# EAGLE design WaterLevel-STM8-V1 (EAGLE 9.6.2)
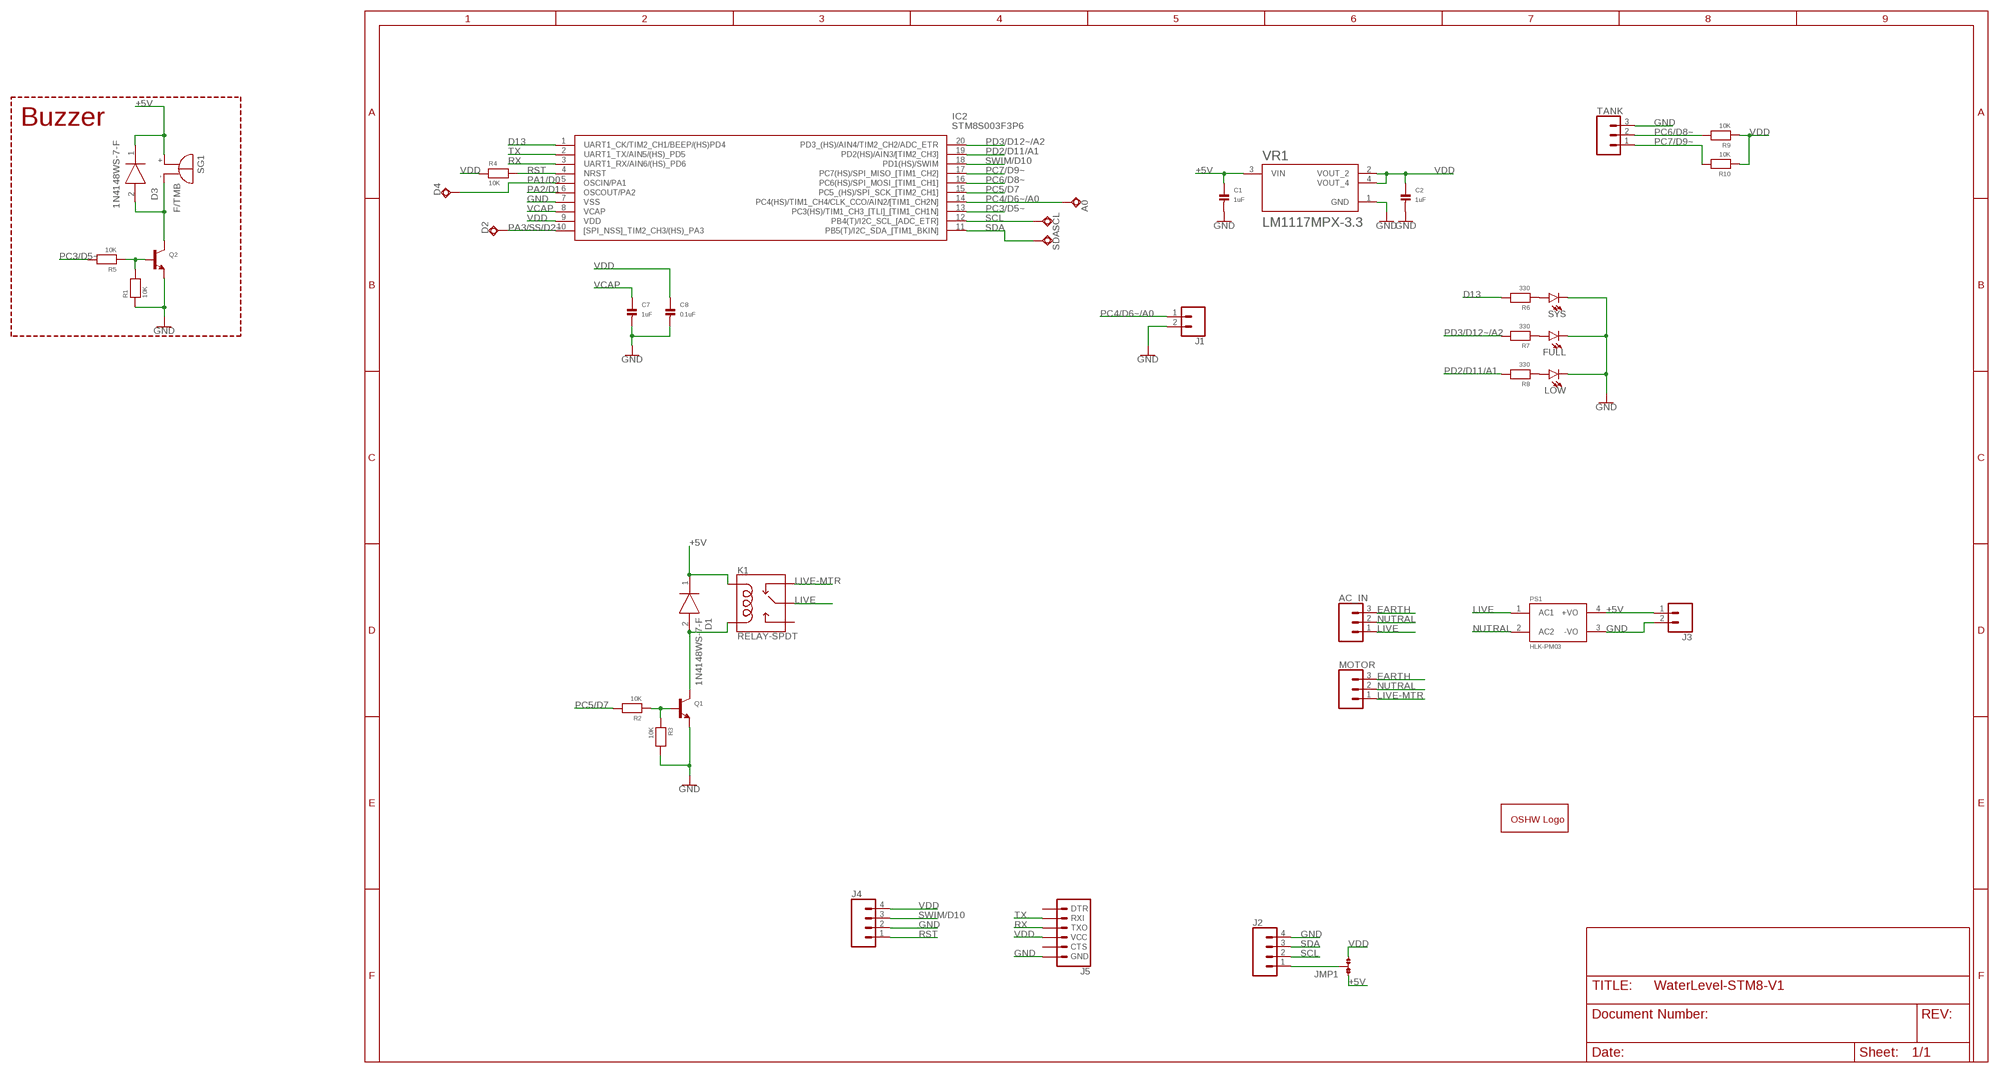
[diagram p0: schematic, sheet 1]

## Parts
A0  TPSQTP20R  [TP20R]
AC_IN  SCREW-CONN_03-SCREW-5MM  [SCREWTERMINAL-5MM-3]
C1  1uF  CAP_CERAMIC0805  [C0805]
C2  1uF  CAP_CERAMIC0805  [C0805]
C7  1uF  CAP_CERAMIC0805  [C0805]
C8  0.1uF  CAP_CERAMIC0805  [C0805]
D1  1N4148WS-7-F  [SOD2513X120N]
D2  TPSQTP20R  [TP20R]
D3  1N4148WS-7-F  [SOD2513X120N]
D4  TPSQTP20R  [TP20R]
FULL  LED-5MM-REC5MM  [LED_5MM]
GOLD_ORB_SM1  OSHWLOGOLOGO16MM  [OSHW_16MM]
IC2  STM8S003F3P6  [SOP65P640X120-20N]
J1  2PIN-2.54MM-POLARPOLAR  [MOLEX-1X2]
J2  CONN_04PTH  [1X04]
J3  2PIN-2.54MM-POLARPOLAR  [MOLEX-1X2]
J4  CONN_04PTH  [1X04]
J5  6_PIN_SERIAL_TARGETSILK  [6_PIN_SERIAL_TARGET_SIDE_W_SILK]
JMP1  JMP-3-NO  [JMP-3-NO]
K1  RELAY-SPDT  [RELAY_G5LE]
LOW  LED-5MM-REC5MM  [LED_5MM]
MOTOR  SCREW-CONN_03-SCREW-5MM  [SCREWTERMINAL-5MM-3]
PS1  HLK-PM03  [CONV_HLK-PM03]
Q1  TRANSISTOR_NPNWIDE  [SOT23-WIDE]
Q2  TRANSISTOR_NPNWIDE  [SOT23-WIDE]
R1  10K  RESISTOR0805  [R0805]
R2  10K  RESISTOR0805  [R0805]
R3  10K  RESISTOR0805  [R0805]
R4  10K  RESISTOR0805  [R0805]
R5  10K  RESISTOR0805  [R0805]
R6  330  RESISTOR0805  [R0805]
R7  330  RESISTOR0805  [R0805]
R8  330  RESISTOR0805  [R0805]
R9  10K  RESISTOR0805  [R0805]
R10  10K  RESISTOR0805  [R0805]
SCL  TPSQTP20R  [TP20R]
SDA  TPSQTP20R  [TP20R]
SG1  F/TMB  [F/TMB]
SYS  LED-5MM-REC5MM  [LED_5MM]
TANK  SCREW-CONN_03-SCREW-5MM  [SCREWTERMINAL-5MM-3]
VR1  LM1117MPX-3.3  [VREG_LM1117MPX-3.3]

## Nets
+5V: C1.1 D1.1(K) D3.1(K) J3.1 JMP1.1 K1.2(COIL1) PS1.4(+VO) SG1.+ VR1.3(VIN)
D13: IC2.1(UART1_CK/TIM2_CH1/BEEP/(HS)PD4) R6.2
EARTH: AC_IN.3 MOTOR.3
GND: C1.2 C2.2 C7.2 C8.2 FULL.K(C) IC2.7(VSS) J1.2 J2.4 J3.2 J4.2 J5.P$6(GND) LOW.K(C) PS1.3(-VO) Q1.2(E) Q2.2(E) R1.1 R3.2 SYS.K(C) TANK.3 VR1.1(GND)
LIVE: AC_IN.1 K1.1(MAIN) PS1.1(AC1)
LIVE-MTR: K1.4(NC) MOTOR.1
N$1: R6.1 SYS.A
N$2: D1.2(A) K1.5(COIL2) Q1.3(C)
N$3: Q1.1(B) R2.1 R3.1
N$4: D3.2(A) Q2.3(C) SG1.-
N$5: Q2.1(B) R1.2 R5.1
N$6: FULL.A R7.1
N$7: LOW.A R8.1
N$8: J2.1 JMP1.2
NUTRAL: AC_IN.2 MOTOR.2 PS1.2(AC2)
PA1/D0: D4.TP IC2.5(OSCIN/PA1)
PA2/D1: IC2.6(OSCOUT/PA2)
PA3/SS/D2~: D2.TP IC2.10([SPI_NSS]_TIM2_CH3/(HS)_PA3)
PC3/D5~: IC2.13(PC3(HS)/TIM1_CH3_[TLI]_[TIM1_CH1N]) R5.2
PC4/D6~/A0: A0.TP IC2.14(PC4(HS)/TIM1_CH4/CLK_CCO/AIN2/[TIM1_CH2N]) J1.1
PC5/D7: IC2.15(PC5_(HS)/SPI_SCK_[TIM2_CH1]) R2.2
PC6/D8~: IC2.16(PC6(HS)/SPI_MOSI_[TIM1_CH1]) R9.2 TANK.2
PC7/D9~: IC2.17(PC7(HS)/SPI_MISO_[TIM1_CH2]) R10.2 TANK.1
PD2/D11/A1: IC2.19(PD2(HS)/AIN3/[TIM2_CH3]) R8.2
PD3/D12~/A2: IC2.20(PD3_(HS)/AIN4/TIM2_CH2/ADC_ETR) R7.2
RST: IC2.4(NRST) J4.1 R4.2
RX: IC2.3(UART1_RX/AIN6/(HS)_PD6) J5.P$2(TXO)
SCL: IC2.12(PB4(T)/I2C_SCL_[ADC_ETR]) J2.2 SCL.TP
SDA: IC2.11(PB5(T)/I2C_SDA_[TIM1_BKIN]) J2.3 SDA.TP
SWIM/D10: IC2.18(PD1(HS)/SWIM) J4.3
TX: IC2.2(UART1_TX/AIN5/(HS)_PD5) J5.P$3(RXI)
VCAP: C7.1 IC2.8(VCAP)
VDD: C2.1 C8.1 IC2.9(VDD) J4.4 J5.P$4(VCC) JMP1.3 R4.1 R9.1 R10.1 VR1.2(VOUT_2) VR1.4(VOUT_4)
Unconnected: J5.P$1(DTR) J5.P$5(CTS) K1.3(NO)

## Notes on the sheet
- Buzzer

## Library data of the parts
A0 D2 D4 SCL SDA = testpad:TPSQ: Test pad
AC_IN MOTOR TANK = electroShri:SCREW-CONN_03: Multi connection point. Often used as Generic Header-pin footprint for 0.1 inch spaced/style header connections On any of the 0.1 inch spaced packages, you can populate with these: Break Away Headers - Straight <https://www.sparkfun.com/products/116> (PRT-00116) Break Away Male Headers - Right Angle <https://www.sparkfun.com/products/553> (PRT-00553) Female Headers <https://www.sparkfun.com/products/115> (PRT-00115) Break Away Headers - Machine Pin <https://www.sparkfun.com/products/117> (PRT-00117) Break Away Female Headers - Swiss Machine Pin <https://www.sparkfun.com/products/743> (PRT-00743) Stackable Header - 3 Pin (Female, 0.1") <https://www.sparkfun.com/products/13875> (PRT-13875) For SCREWTERMINALS and SPRING TERMINALS visit here: Screw Terimnals on SparkFun.com <https://www.sparkfun.com/search/results?term=Screw+Terminals> (5mm/3.5mm/2.54mm spacing) This device is also useful as a general connection point to wire up your design to another part of your project. Our various solder wires solder well into these plated through hole pads. Hook-Up Wire - Assortment (Stranded, 22 AWG) <https://www.sparkfun.com/products/11375> (PRT-11375) Hook-Up Wire - Assortment (Solid Core, 22 AWG) <https://www.sparkfun.com/products/11367> (PRT-11367) View the entire wire category on our website here <https://www.sparkfun.com/categories/141> Special notes: Molex polarized connector foot print use with SKU : PRT-08232 with associated crimp pins and housings.; PROD_ID: CONN-10134; SF_SKU: PRT-08433
C1 C2 C7 C8 = eventHorizon:CAP_CERAMIC: Ceramic Capacitors 0402 - 0402 Surface Mount Capacitors 16pF 50V 5% [Digikey: 445-4899-2-ND] 18pF 50V 5% [Digikey: 490-1281-2-ND] 22pF 50V 5% [Digikey: 490-1283-2-ND] 68pF 50V 5% [Digikey: 490-1289-2-ND] 0.1uF 10V 10% [Digikey: 490-1318-2-ND] 1.0uF 6.3V 10% [Digikey: 490-1320-2-ND] 0603 - 0603 Surface Mount Capacitors 16 pF 50V 5% [Digikey: 445-5051-2-ND] 22 pF 50V [Digikey: PCC220ACVTR-ND] 33 pF 50V 5% [Digikey: 490-1415-1-ND] 56pF 50V 5% [Digikey: 490-1421-1-ND] 220pF 50V 5% [Digikey: 445-1285-1-ND] 680 pF 50V 2200 pF 50V 5% C0G [Digikey: 445-1297-1-ND] 5600 pF 100V 5% X7R [Digikey: 478-3711-1-ND] 0.1 µF 25V 10% [Digikey: PCC2277TR-ND] 0.22 µF 16V 10% X7R [Digikey: 445-1318-1-ND] 1.0 µF 25V 10% [Digikey: 445-5146-2-ND] 0603 - RF Specific 3pF 250V +/-0.1pF RF [Digikey: 712-1347-1-ND] 18 pF 250V 5% [Digikey: 478-3505-1-ND or 712-1322-1-ND] 56 pF 250V 5% C0G RF [Digikey: 490-4867-1-ND] 68 pF 250V RF [Digikey: 490-4868-1-ND] 0805 - 0805 Surface Mount Capacitors 220 pF 250V 2% RF Ceramic Capacitor [Digikey: 712-1398-1-ND] 1000 pF 50V 2% NP0 Ceramic Capacitor [Digikey: 478-3760-1-ND] 0.1 µF 25V 10% Ceramic Capacitor [Digikey: PCC1828TR-ND] 1.0 µF 16V 10% Ceramic Capacitor[Digikey: 490-1691-2-ND] 10.0 µF 10V 10% Ceramic Capacitor[Digikey: 709-1228-1-ND] 10.0 uF 16V 10% Ceramic Capacitor [Digikey: 478-5165-2-ND] 47 uF 6.3V 20% Ceramic Capacitor [Digikey: 587-1779-1-ND or 399-5506-1-ND] 1206 - 1206 Surface Mount Capacitors 47uF 10V 20% Ceramic Capacitor [Digikey: 490-5528-1-ND or 399-5508-1-ND or 445-6010-1-ND] 100uF 6.3V -20%, +80% Y5V Ceramic Capacitor (Digikey: 490-4512-1-ND, Mouser: 81-GRM31CF50J107ZE1L)
D1 D3 = electroShri:1N4148WS-7-F: Diode Switching 150mA 75V 200mW SOD323 Diodes Inc 1N4148WS-7-F Switching Diode, 150mA 75V, 2-Pin SOD-323 Source: Datasheet <https://componentsearchengine.com/Datasheets/2/1N4148WS-7-F.pdf>; ARROW_PART_NUMBER: 1N4148WS-7-F; ARROW_PRICE-STOCK: https://www.arrow.com/en/products/1n4148ws-7-f/diodes-incorporated; DESCRIPTION: Diode Switching 150mA 75V 200mW SOD323 Diodes Inc 1N4148WS-7-F Switching Diode, 150mA 75V, 2-Pin SOD-323; HEIGHT: 1.2mm; MANUFACTURER_NAME: Diodes Inc.; MANUFACTURER_PART_NUMBER: 1N4148WS-7-F; MOUSER_PART_NUMBER: 621-1N4148WS-F; MOUSER_PRICE-STOCK: https://www.mouser.co.uk/ProductDetail/Diodes-Incorporated/1N4148WS-7-F?qs=4drIV0IxA0r8aNy7%2Fu4kVw%3D%3D
FULL LOW SYS = electroShri:LED-5MM-REC: LED (Generic) Standard schematic elements and footprints for 5mm, 3mm, 1206, and 0603 sized LEDs. Generic LEDs with no color specified.
GOLD_ORB_SM1 = electroShri:OSHWLOGO: The OSHW logo for PCB layout
IC2 = electroShri:STM8S003F3P6: STMICROELECTRONICS - STM8S003F3P6 - MCU, 8BIT, STM8, 16MHZ, TSSOP-20 Source: Datasheet <http://www.st.com/web/en/resource/technical/document/datasheet/DM00024550.pdf>; ARROW_PART_NUMBER: STM8S003F3P6; ARROW_PRICE-STOCK: https://www.arrow.com/en/products/stm8s003f3p6/stmicroelectronics; DESCRIPTION: STMICROELECTRONICS - STM8S003F3P6 - MCU, 8BIT, STM8, 16MHZ, TSSOP-20; HEIGHT: 1.2mm; MANUFACTURER_NAME: STMicroelectronics; MANUFACTURER_PART_NUMBER: STM8S003F3P6; MOUSER_PART_NUMBER: 511-STM8S003F3P6; MOUSER_PRICE-STOCK: https://www.mouser.co.uk/ProductDetail/STMicroelectronics/STM8S003F3P6?qs=vV0pr1uq7fD%252BGii5YhjnYw%3D%3D
J1 J3 = electroShri:2PIN-2.54MM-POLAR: Multi connection point. Often used as Generic Header-pin footprint for 0.1 inch spaced/style header connections On any of the 0.1 inch spaced packages, you can populate with these: Break Away Headers - Straight <https://www.sparkfun.com/products/116> (PRT-00116) Break Away Male Headers - Right Angle <https://www.sparkfun.com/products/553> (PRT-00553) Female Headers <https://www.sparkfun.com/products/115> (PRT-00115) Break Away Headers - Machine Pin <https://www.sparkfun.com/products/117> (PRT-00117) Break Away Female Headers - Swiss Machine Pin <https://www.sparkfun.com/products/743> (PRT-00743) For SCREWTERMINALS and SPRING TERMINALS visit here: Screw Terimnals on SparkFun.com <https://www.sparkfun.com/search/results?term=Screw+Terminals> (5mm/3.5mm/2.54mm spacing) This device is also useful as a general connection point to wire up your design to another part of your project. Our various solder wires solder well into these plated through hole pads. Hook-Up Wire - Assortment (Stranded, 22 AWG) <https://www.sparkfun.com/products/11375> (PRT-11375) Hook-Up Wire - Assortment (Solid Core, 22 AWG) <https://www.sparkfun.com/products/11367> (PRT-11367) View the entire wire category on our website here <https://www.sparkfun.com/categories/141> Special notes: Molex polarized connector foot print use with: PRT-08233 with associated crimp pins and housings. 2.54_SCREWTERM for use with PRT-10571. 3.5mm Screw Terminal footprints for PRT-08084 5mm Screw Terminal footprints for use with PRT-08432; SF_ID: PRT-09918
J2 J4 = SparkFun-Connectors:CONN_04: Multi connection point. Often used as Generic Header-pin footprint for 0.1 inch spaced/style header connections On any of the 0.1 inch spaced packages, you can populate with these: Break Away Headers - Straight <https://www.sparkfun.com/products/116> (PRT-00116) Break Away Male Headers - Right Angle <https://www.sparkfun.com/products/553> (PRT-00553) Female Headers <https://www.sparkfun.com/products/115> (PRT-00115) Break Away Headers - Machine Pin <https://www.sparkfun.com/products/117> (PRT-00117) Break Away Female Headers - Swiss Machine Pin <https://www.sparkfun.com/products/743> (PRT-00743) For SCREWTERMINALS and SPRING TERMINALS visit here: Screw Terimnals on SparkFun.com <https://www.sparkfun.com/search/results?term=Screw+Terminals> (5mm/3.5mm/2.54mm spacing) This device is also useful as a general connection point to wire up your design to another part of your project. Our various solder wires solder well into these plated through hole pads. Hook-Up Wire - Assortment (Stranded, 22 AWG) <https://www.sparkfun.com/products/11375> (PRT-11375) Hook-Up Wire - Assortment (Solid Core, 22 AWG) <https://www.sparkfun.com/products/11367> (PRT-11367) View the entire wire category on our website here <https://www.sparkfun.com/categories/141> Special notes: Molex polarized connector foot print use with SKU : PRT-08231 with associated crimp pins and housings. 1MM SMD Version SKU: PRT-10208; PROD_ID: CONN-09696
J5 = electroShri:6_PIN_SERIAL_TARGET: 6-pin header connection for use with the "FTDI BASIC" pinout - TARGET SIDE. Also known as "Arduino Serial Program Header". It is used to mate with our FTDI Basic serial programmers using the Arduino IDE. Note, this device has "TARGET" in the name. It is intended to be used on a design that contains a target micro-controller that you wish to program. The "sister" device, named "CABLE" is inteneded to be used on a design that usually lives on the end of your USB cable and prvides the converter chip (FTDI232 or FTDI231x) to commnicate serial RX/TX. You can populate with some of these: Break Away Headers - Straight <https://www.sparkfun.com/products/116> (PRT-00116) For reference (or to suit your programming needs) check out these designs: SparkFun FTDI Basic Breakout - 5V <https://www.sparkfun.com/products/9716> (DEV-09716) SparkFun FTDI Basic Breakout - 3.3V <https://www.sparkfun.com/products/9873> (DEV-09873) SparkFun FTDI SmartBasic <https://www.sparkfun.com/products/12935> (DEV-12935) SparkFun Beefy 3 - FTDI Basic Breakout <https://www.sparkfun.com/products/13746> (DEV-13746)
JMP1 = PatternAgents-ProtoPads:JMP-3-NO: Three Terminal Jumper - Normally Open All Pads Open (unconnected) PatternAgents ProtoPads Library Schematic and PCB layout libraries for design patterns by PatternAgents. For the CADSoft Eagle CAD program : http://www.cadsoftusa.com/download-eagle/ Source LBR : http://www.patternagents.com Github : https://github.com/PatternAgents License : http://creativecommons.org/licenses/by-sa/4.0/ (Creative Commons 4.0) THIS SOFTWARE IS PROVIDED BY THE CONTRIBUTORS "AS IS" AND WITHOUT ANY EXPRESS OR IMPLIED WARRANTIES, INCLUDING, BUT NOT LIMITED TO, THE IMPLIED WARRANTIES OF MERCHANTABILITY AND FITNESS FOR A PARTICULAR PURPOSE ARE DISCLAIMED. IN NO EVENT SHALL THE COPYRIGHT OWNER OR CONTRIBUTORS BE LIABLE FOR ANY DIRECT, INDIRECT, INCIDENTAL, SPECIAL, EXEMPLARY, OR CONSEQUENTIAL DAMAGES (INCLUDING, BUT NOT LIMITED TO, PROCUREMENT OF SUBSTITUTE GOODS OR SERVICES; LOSS OF USE, DATA, OR PROFITS; OR BUSINESS INTERRUPTION) HOWEVER CAUSED AND ON ANY THEORY OF LIABILITY, WHETHER IN CONTRACT, STRICT LIABILITY, OR TORT (INCLUDING NEGLIGENCE OR OTHERWISE) ARISING IN ANY WAY OUT OF THE USE OF THIS SOFTWARE, EVEN IF ADVISED OF THE POSSIBILITY OF SUCH DAMAGE.; BOM: EXCLUDE
K1 = electroShri:RELAY-SPDT: SPDT Electromechanical Relay Single-pole, double-throw sealed relays. When current is applied to the coil, it throws a simple changeover switch, terminating the connection from the NC contact to ground and closing the NO contact. Use them to switch high voltage/high current devices. SparkFun Products JQX-15F: Relay SPDT Sealed - 20A <https://www.sparkfun.com/products/10924> (COM-10924) JZC-11F: Relay SPDT Sealed <https://www.sparkfun.com/products/100> (COM-00100); PROD_ID: COMP-14214
PS1 = electroShri:HLK-PM03: AC DC 3W power module; AVAILABILITY: Unavailable; MF: Hi-link; MP: HLK-PM03; PACKAGE: Package; PRICE: None
Q1 Q2 = eventHorizon:TRANSISTOR_NPN: NPN Transistor Transistor (NPN) 500mA 45V - BC817 [Digikey: 568-1631-1-ND] Transistor (NPN) 500mA 45V - BC817,215 [Mouser: 771-BC817-T/R] SOT23-R - SOT23 footprint optimised for use with solder paste and reflow ovens. SOT23-W - SOT23 footprint optimised for hand-soldering (larger pads).
R1-R10 = eventHorizon:RESISTOR: Resistors 0402 - 0402 Surface Mount Package 22 Ohm 1% 1/16W [Digikey: 311-22.0LRTR-ND] 33 Ohm 5% 1/16W 1.0K 5% 1/16W 1.5K 5% 1/16W 2.0K 1% 1/16W 10.0K 1% 1/16W [Digikey: 311-10.0KLRTR-ND] 10.0K 5% 1/16W [Digikey: RMCF0402JT10K0TR-ND] 12.1K 1% 1/16W [Digikey: 311-22.0LRTR-ND] 100.0K 5% 1/16W 0603 - 0603 Surface Mount Package 0 Ohm 1/10 Watt 1% Resistor 15 Ohm 1/10 Watt 1% Resistor 33 Ohm 1/10 Watt 1% Resistor 49.9 Ohm 1/10 Watt 1% Resistor 100 Ohm 1/10 Watt 1% Resistor 150 Ohm 1/10 Watt 1% Resistor 240 Ohm 1/10 Watt 1% Resistor 390 Ohm 1/10 Watt 1% Resistor 560 Ohm 1/10 Watt 1% Resistor 680 Ohm 1/10 Watt 1% Resistor 750 Ohm 1/10 Watt 1% Resistor 1.0K Ohm 1/10 Watt 1% Resistor 1.5K Ohm 1/10 Watt 1% Resistor 2.0K Ohm 1/10 Watt 1% Resistor 2.2K Ohm 1/10 Watt 1% Resistor 3.3K Ohm 1/10 Watt 1% Resistor 4.7K Ohm 1/10 Watt 1% Resistor 10.0K Ohm 1/10 Watt 1% Resistor 12.0K Ohm 1/10 Watt 1% Resistor 12.1K Ohm 1/10 Watt 1% Resistor 20.0K Ohm 1/10 Watt 1% Resistor 33.0K Ohm 1/10 Watt 1% Resistor 100.0K Ohm 1/10 Watt 1% Resistor 0805 - 0805 Surface Mount Package 0 Ohm 1/8 Watt 1% Resistor 33 Ohm 1/8 Watt 1% Resistor 100 Ohm 1/8 Watt 1% Resistor 150 Ohm 1/8 Watt 1% Resistor 200 Ohm 1/8 Watt 1% Resistor 240 Ohm 1/8 Watt 1% Resistor 330 Ohm 1/8 Watt 1% Resistor 390 Ohm 1/8 Watt 1% Resistor 470 Ohm 1/8 Watt 1% Resistor 1.0K Ohm 1/8 Watt 1% Resistor 1.5K Ohm 1/8 Watt 1% Resistor 2.0K Ohm 1/8 Watt 1% Resistor 4.7K Ohm 1/8 Watt 1% Resistor 5.1K Ohm 1/8 Watt 1% Resistor 5.6K Ohm 1/8 Watt 1% Resistor 10.0K Ohm 1/8 Watt 1% Resistor 22.0K Ohm 1/8 Watt 1% Resistor 33.0K Ohm 1/8 Watt 1% Resistor 100K Ohm 1/8 Watt 1% Resistor 1206 - 1206 Surface Mount Package 2012 - 2010 Surface Mount Package 0.11 Ohm 1/2 Watt 1% Resistor - Digikey: RHM.11UCT-ND
SG1 = eventHorizon:F/TMB: BUZZER Source: Buerklin; OC_FARNELL: unknown; OC_NEWARK: unknown
VR1 = electroShri:LM1117MPX-3.3: 800-mA 15-V linear voltage regulator 4-SOT-223 0 to 125 Check prices <https://snapeda.com/parts/LM1117MPX-3.3/Texas%20Instruments/view-part/?ref=eda>; AVAILABILITY: Warning; DESCRIPTION: 800-mA 15-V linear voltage regulator 4-SOT-223; MF: Texas Instruments; MOUSER-PURCHASE-URL: https://snapeda.com/shop?store=Mouser&id=78946; MP: LM1117MPX-3.3; PACKAGE: SOT-223-4 Texas Instruments; PRICE: None; TEXAS_INSTRUMENTS-PURCHASE-URL: https://snapeda.com/shop?store=Texas+Instruments&id=78946

## Net classes
0 default: width 0.203 mm, drill 0.356 mm, clearance 0.254 mm

## Board
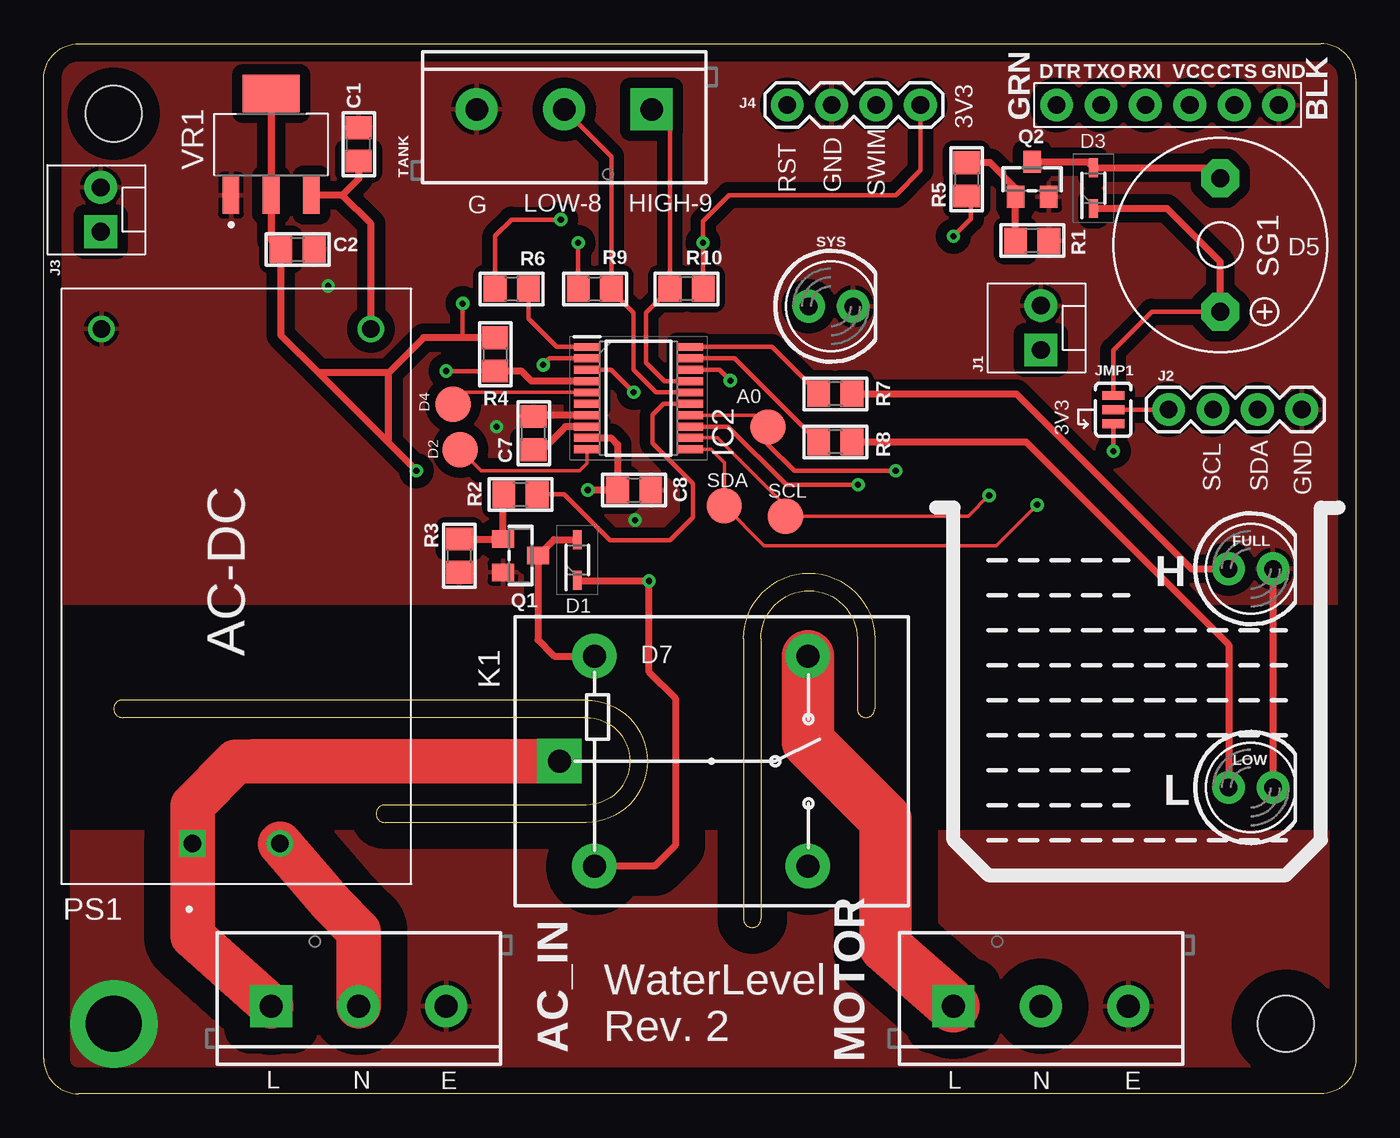
[diagram p1: board, top side]
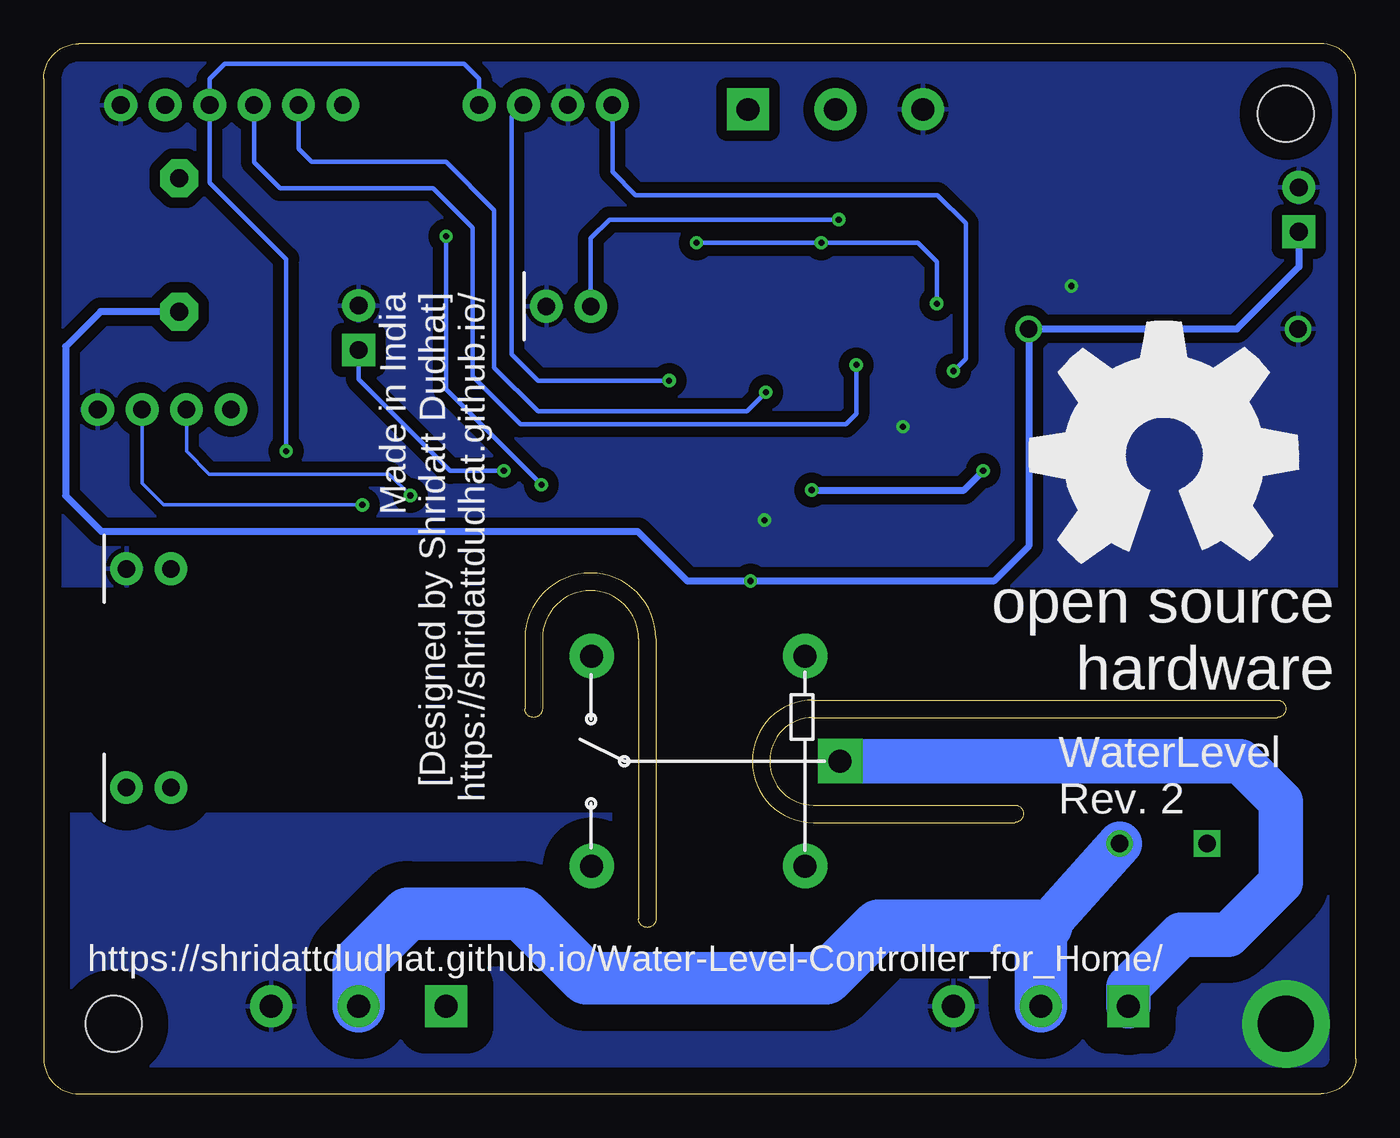
[diagram p2: board, bottom side, seen from below]

Size 75 x 60 mm. Coordinates in mm from the lower left corner, seen from the top.
Outline: 0,2 0,58 arc-90 2,60 73,60 arc-90 75,58 75,2 arc-90 73,0 2,0 arc-90 0,2
Outline: 31,16.5 19.5,16.5 arc180 19.5,15.5 31,15.5 arc180 31,22.5 4.5,22.5 arc180 4.5,21.5 31,21.5 arc-180 31,16.5
Outline: 46.5,26 46.5,22 arc180 47.5,22 47.5,26 arc180 40,26 40,10 arc180 41,10 41,26 arc-180 46.5,26
Copper layers (1*16): Top 0.035mm / dielectric 1.5mm / Bottom 0.035mm
Design rules "default": minimum track width 6mil, minimum drill 0.35mm, track to track 6mil, track to pad 6mil, pad to pad 6mil, via to via 6mil, smd to smd 6mil, copper to edge 40mil, drill to drill 6mil, minimum pad ring 10mil, minimum via ring 8mil, stop-mask expansion 4mil, vias tented up to drill 0mil, thermal gap 10mil
Holes 3.2 mm at 71,4 4,56

### Footprints (pad centres in the part's own frame; a part is rotated, then mirrored left to right if it is on the bottom)
TP20R = smd 2 x 2: TP 0,0
SCREWTERMINAL-5MM-3 = drill 1.3 pad 2.413 square: 1 0,0 | drill 1.3 pad 2.413: 2 5,0; 3 10,0
C0805 = smd 1.3 x 1.5: 1 -0.95,0; 2 0.95,0
SOD2513X120N = smd 1.075 x 0.5: 1 -1.162,0; 2 1.162,0
LED_5MM = drill 1 pad 1.88: A -1.27,0; K 1.27,0
SOP65P640X120-20N = smd 1.475 x 0.45: 1 -2.938,2.925; 2 -2.938,2.275; 3 -2.938,1.625; 4 -2.938,0.975; 5 -2.938,0.325; 6 -2.938,-0.325; 7 -2.938,-0.975; 8 -2.938,-1.625; 9 -2.938,-2.275; 10 -2.938,-2.925; 11 2.938,-2.925; 12 2.938,-2.275; 13 2.938,-1.625; 14 2.938,-0.975; 15 2.938,-0.325; 16 2.938,0.325; 17 2.938,0.975; 18 2.938,1.625; 19 2.938,2.275; 20 2.938,2.925
MOLEX-1X2 = drill 1.016 pad 1.88 square: 1 0,0 | drill 1.016 pad 1.88: 2 2.54,0
1X04 = drill 1.016 pad 1.88: 1 0,0; 2 2.54,0; 3 5.08,0; 4 7.62,0
6_PIN_SERIAL_TARGET_SIDE_W_SILK = drill 1.016 pad 1.88: P$1 -6.35,0; P$2 -3.81,0; P$3 -1.27,0; P$4 1.27,0; P$5 3.81,0; P$6 6.35,0
JMP-3-NO = smd 0.508 x 1.27: 1 -0.813,0; 2 0,0; 3 0.813,0
RELAY_G5LE = drill 1.3 pad 2.54 square: 1 8.52,-0.005 | drill 1.3 pad 2.54: 2 6.52,5.995; 3 -5.68,5.995; 4 -5.68,-6.005; 5 6.52,-6.005
CONV_HLK-PM03 = drill 1 square: 1 -14.7,2.5 | drill 1: 2 -14.7,-2.5; 3 14.7,7.7; 4 14.7,-7.7
SOT23-WIDE = smd 1 x 1.27: 1 -0.95,-1; 2 0.95,-1; 3 0,1
R0805 = smd 1.3 x 1.5: 1 -0.95,0; 2 0.95,0
F/TMB = drill 1.016 pad 2.159 octagon: + 3.81,0; - -3.81,0
VREG_LM1117MPX-3.3 = smd 2.15 x 0.95: 1 -2.9,2.3; 2 -2.9,0; 3 -2.9,-2.3 | smd 2.15 x 3.25: 4 2.9,0

### Placement (x,y rotation side)
A0  41.4,38.1 0 top
AC_IN  13,5 0 top
C1  18,54.25 90 top
C2  14.5,48.25 0 top
C7  28,37.75 90 top
C8  33.75,34.5 0 top
D1  30.5,30.5 90 top
D2  23.8,36.8 0 top
D3  60,51.75 90 top
D4  23.4,39.4 0 top
FULL  69,30 0 top
GOLD_ORB_SM1  11,36.5 0 bottom
IC2  34,39.75 0 top
J1  57,42.5 90 top
J2  64.3,39.1 0 top
J3  3.25,49.25 90 top
J4  42.5,56.5 0 top
J5  64.25,56.5 0 top
JMP1  61.14,39.09 270 top
K1  38,19 180 top
LOW  69,17.5 0 top
MOTOR  52,5 0 top
PS1  11,29 90 top
Q1  27.25,30.75 270 top
Q2  56.5,52.25 0 top
R1  56.5,48.75 180 top
R2  27.25,34.25 0 top
R3  23.75,30.75 270 top
R4  25.8,42.25 270 top
R5  52.75,52.25 270 top
R6  26.75,46 0 top
R7  45.25,40 180 top
R8  45.25,37.25 180 top
R9  31.5,46 0 top
R10  36.75,46 180 top
SCL  42.4,33 0 top
SDA  38.9,33.6 0 top
SG1  67.25,48.5 270 top
SYS  45,45 0 top
TANK  34.75,56.25 180 top
VR1  13,54.25 90 top

### Tracks (layer width: path | path; a pad name or v marks a point on that pad's centre or on a via)
+5V  (via drill 0.36)
  Top 0.254: JMP1.1 61.14,42.5 63.33,44.69 SG1.+
  Top 0.406: PS1.4 18.7,49.7 17.05,51.35 | 17.05,51.35 VR1.3 | C1.1 18,52.3 17.05,51.35 | K1.2 34.9,13.01 36.1,14.2 36.1,22.6 34.6,24.1 v34.6,29.3 30.54,29.3 D1.1 | D3.1 64.21,50.59 67.25,47.55 SG1.+
  Bottom 0.406: J3.1 3.25,47.25 6.8,43.7 PS1.4 18.7,31.3 20.7,29.3 v34.6,29.3 38.21,29.3 41.03,32.12 71.69,32.12 73.75,34.18 73.75,42.69 71.75,44.69 SG1.+
D13
  Top 0.254: IC2.1 29.32,42.67 27.7,44.3 R6.2
EARTH  (via drill 3.2 pad 5)
  other vias: 4,4
  pour Top (isolate 1.5): -1,15 -1,-1 77,-1 77,15
  pour Bottom (isolate 1.5): -2,16 -2,-2 76,-2 76,16
GND  (via drill 0.35)
  Top 0.406: IC2.7 28.07,38.77 C7.2 | FULL.K LOW.K
  other vias: 16.26,46.16 25.89,38.11 33.8,32.78
  pour Top (isolate 0.61): -1,28 -1,61 76,61 76,28
  pour Bottom (isolate 0.61): -0.5,29 -0.5,60.5 75.5,60.5 75.5,29
LIVE
  Top 2.54: K1.1 12.01,19 10.98,18.98 8.5,16.5 PS1.1 8.5,9 AC_IN.1
  Bottom 2.54: K1.1 6.61,19 4.3,16.7 4.3,12.1 7.3,9.1 10,9.1 13,6.1 AC_IN.1
LIVE-MTR
  Top 3: K1.4 43.68,20.12 48.1,15.7 48.1,8.4 MOTOR.1
N$1  (via drill 0.36)
  Top 0.254: R6.1 25.8,49.02 26.73,49.95 v29.56,49.95
  Bottom 0.254: v29.56,49.95 42.67,49.95 43.73,48.89 SYS.A
N$2
  Top 0.406: D1.2 29.16,31.66 Q1.3 28.25,25.93 29.18,25 K1.5
N$3
  Top 0.406: R3.1 Q1.1 26.25,34.2 R2.1
N$4
  Top 0.406: Q2.3 59.66,53.25 D3.2 66.65,52.91 SG1.-
N$5
  Top 0.406: R1.2 Q2.1 55.55,51.75 54.1,53.2 R5.1
N$6
  Top 0.406: R7.1 55.6,40 65.6,30 FULL.A
N$7
  Top 0.406: R8.1 56.15,37.25 67.73,25.67 LOW.A
N$8
  Top 0.254: JMP1.2 J2.1
NUTRAL
  Top 2.54: PS1.2 16.5,10.8 18,9.3 AC_IN.2
  Bottom 2.54: PS1.2 17.7,9.6 18,9.3
  Bottom 3: 17.7,9.6 27.3,9.6 30.3,6.6 44,6.6 47.7,10.3 54.2,10.3 57,7.5 MOTOR.2 | AC_IN.2 18,9.3
PA1/D0
  Top 0.203: IC2.5 24.07,40.08 D4.TP
PA3/SS/D2~
  Top 0.203: IC2.10 31.06,36.02 30.64,35.6 25,35.6 D2.TP
PC3/D5~  (via drill 0.36)
  Top 0.254: IC2.13 39.12,38.12 42.45,34.8 v46.55,34.8 | v52,49 53,50 53,51.05 R5.2
  Bottom 0.254: v46.55,34.8 52,40.25 v52,49
PC4/D6~/A0  (via drill 0.36)
  Top 0.203: IC2.14 40.73,38.77 A0.TP
  Top 0.254: A0.TP 41.4,37.1 42.9,35.6 v48.7,35.6
  Bottom 0.254: v48.7,35.6 51.77,35.6 57,40.83 J1.1
PC5/D7
  Top 0.254: R2.2 29.75,34.25 32.37,31.63 35.81,31.63 37.12,32.94 37.12,34.85 34.81,37.16 34.81,38.81 35.42,39.42 IC2.15
PC6/D8~
  Top 0.254: IC2.16 34.99,40.08 33.71,41.36 33.71,44.64 32.45,45.9 R9.2 32.45,53.55 TANK.2
PC7/D9~
  Top 0.254: IC2.17 35.48,40.73 34.43,41.77 34.43,44.63 R10.2 35.8,55.2 TANK.1
PD2/D11/A1
  Top 0.254: IC2.19 39.48,42.02 44.25,37.25 R8.2
PD3/D12~/A2
  Top 0.254: IC2.20 41.62,42.67 R7.2
RST  (via drill 0.36)
  Top 0.254: R4.2 v23,41.3
  Top 0.406: IC2.4 27.88,40.73 27.3,41.3 R4.2
  Bottom 0.254: v23,41.3 22.3,42 22.3,49.73 23.92,51.35 41.16,51.35 42.5,52.69 J4.1
RX  (via drill 0.36)
  Top 0.254: IC2.3 32.44,41.38 v33.72,40.09
  Bottom 0.254: v33.72,40.09 34.81,39 46.75,39 49.25,41.5 49.25,50.5 52,53.25 59.69,53.25 60.44,54 J5.P$2
SCL  (via drill 0.36)
  Top 0.203: IC2.12 38.52,37.48 42.4,33.6 SCL.TP 52.85,33 v54.04,34.19
  Bottom 0.203: v54.04,34.19 55.26,35.41 65.53,35.41 66.84,36.72 J2.2
SDA  (via drill 0.36)
  Top 0.203: IC2.11 38.14,36.83 38.9,36.06 SDA.TP 41.18,31.32 54.46,31.32 v56.79,33.65
  Bottom 0.203: v56.79,33.65 68.15,33.65 69.38,34.88 J2.3
SWIM/D10  (via drill 0.36)
  Top 0.254: IC2.18 38.62,41.38 v39.25,40.75
  Bottom 0.254: v39.25,40.75 46.75,40.75 48.25,42.25 48.25,55.83 J4.3
TX  (via drill 0.36)
  Top 0.254: IC2.2 28.93,42.02 v28.55,41.65
  Bottom 0.254: v28.55,41.65 28.55,38.85 29.15,38.25 47.75,38.25 50.5,41 50.5,49.5 52.75,51.75 61.5,51.75 62.98,53.23 J5.P$3
VCAP
  Top 0.406: IC2.8 29.82,38.12 28.5,36.8 C7.1
VDD  (via drill 0.36)
  Top 0.254: J4.4 50.12,52.77 48.7,51.35 39.17,51.35 37.69,49.87 v37.69,48.63 R10.1 | v30.55,48.63 R9.1 | v23.95,45.15 23.95,43.21 23.94,43.2 | JMP1.3 v61.14,36.72
  Top 0.406: VR1.4 VR1.2 13,48.8 C2.1 13.55,43.35 15.7,41.2 | 19.7,41.2 15.7,41.2 | R4.1 23.94,43.2 21.7,43.2 19.7,41.2 | IC2.9 32.42,37.48 32.8,37.1 C8.1 v31.1,34.5 | 19.7,41.2 19.7,37.2 v21.3,35.6 15.7,41.2
  Bottom 0.254: J4.4 50.12,58 50.98,58.86 64.66,58.86 65.52,58 J5.P$4 65.52,52.07 61.14,47.69 v61.14,36.72 | v37.69,48.63 v30.55,48.63 25.03,48.63 23.95,47.55 v23.95,45.15
  Bottom 0.406: v31.1,34.5 22.4,34.5 v21.3,35.6

### Text on the board
tPlace: 3V3 | RST | GND | SWIM | G | LOW-8 | HIGH-9 | D5 | 3V3 | SCL | SDA | GND | H | AC-DC | D7 | L | WaterLevel / Rev. 2 | L | N | E | L | N | E
bPlace: Made in India / [Designed by Shridatt Dudhat] / https://shridattdudhat.github.io/ | WaterLevel / Rev. 2 | https://shridattdudhat.github.io/Water-Level-Controller_for_Home/